# Altium schematic sheet 智能家居-网关.SchDoc
size A4
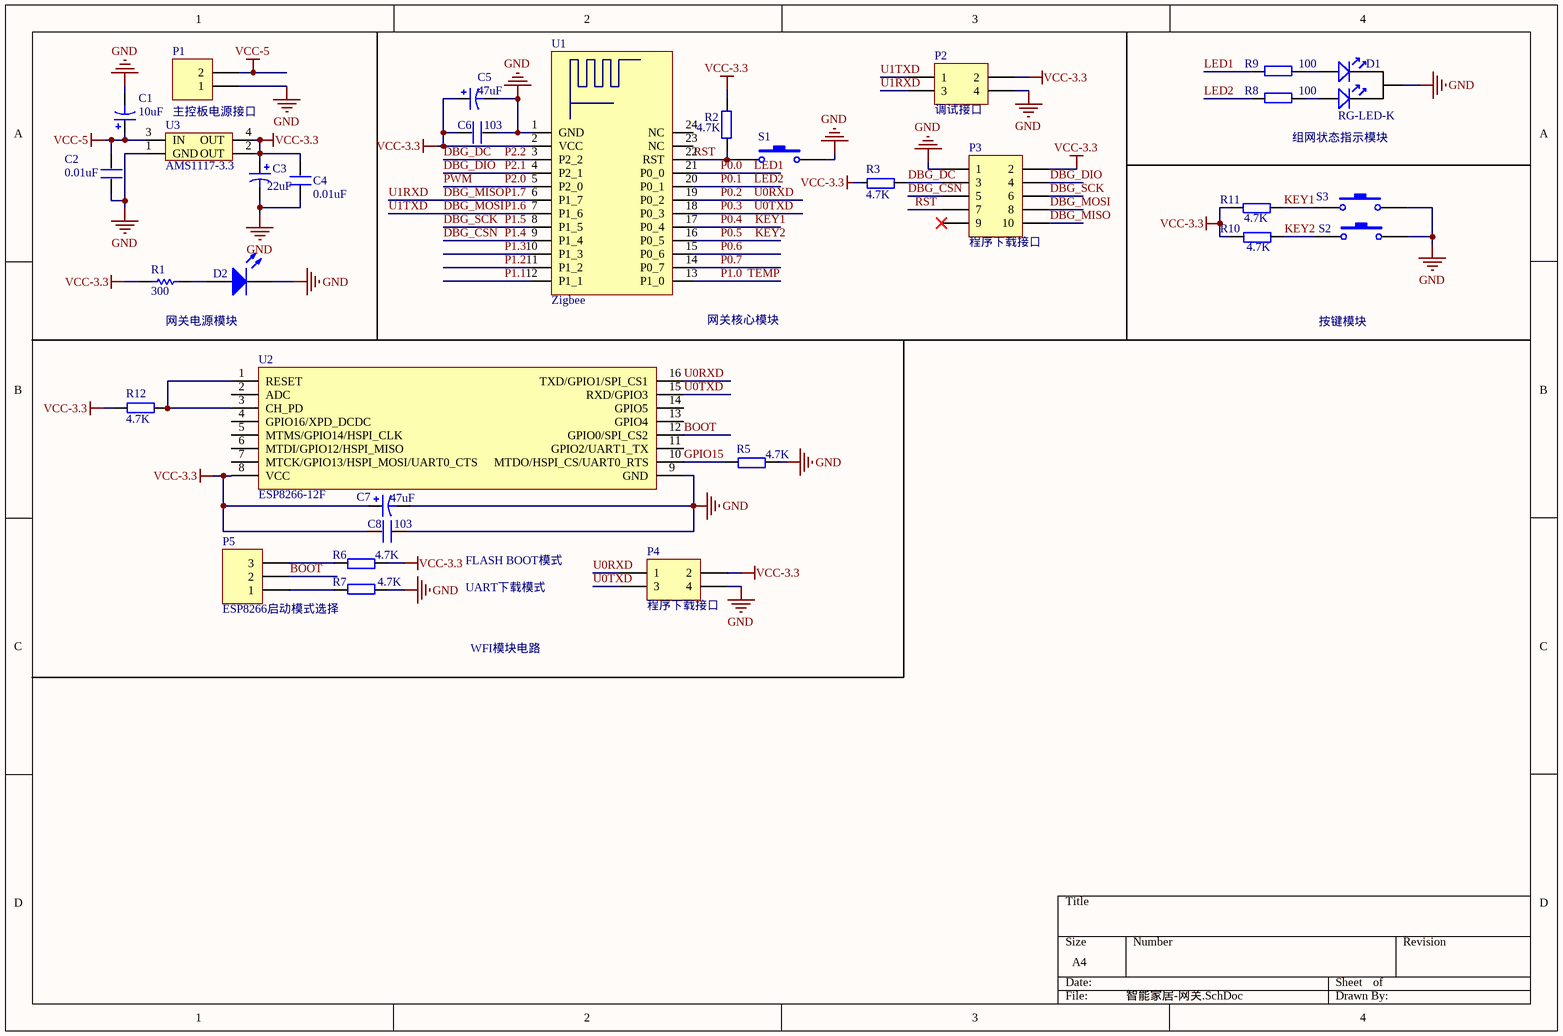
[diagram p0: 智能家居-网关.SchDoc]

## Parts
C1  value 10uF  [CD5]  (hidden comment: Cap Pol1)
C2  0.01uF  [0.1UF]
C3  value 22uF  [CD5]  (hidden comment: Cap Pol1)
C4  0.01uF  [0.1UF]
C5  value 47uF  [CD5]  (hidden comment: Cap Pol1)
C6  103  [0.1UF]
C7  value 47uF  [CD5]  (hidden comment: Cap Pol1)
C8  103  [0.1UF]
D1  RG-LED-K  [RG-LED]
D2  LED0  [LED-3]  (value not drawn)
P1  主控板电源接口  [DG1282]
P2  调试接口  [HDR2X2]
P3  程序下载接口  [HDR2X5]
P4  程序下载接口  [HDR2X2]
P5  ESP8266启动模式选择  [HDR1X3]
R1  value 300  [AXIAL-0.3]  (hidden comment: Res1)
R2  4.7K  [AXIAL-0.3]
R3  4.7K  [AXIAL-0.3]
R5  4.7K  [AXIAL-0.3]
R6  4.7K  [AXIAL-0.3]
R7  4.7K  [AXIAL-0.3]
R8  100  [AXIAL-0.3]
R9  100  [AXIAL-0.3]
R10  4.7K  [AXIAL-0.3]
R11  4.7K  [AXIAL-0.3]
R12  4.7K  [AXIAL-0.3]
S1  SW-PB  [KEY_M]  (value not drawn)
S2  SW-PB  [KEY_M]  (value not drawn)
S3  SW-PB  [KEY_M]  (value not drawn)
U1  Zigbee  [E18-MD0-1]
U2  ESP8266-12F  [ESP8266 - 12S]
U3  AMS1117-3.3  [AMS1117]

## Nets
GND: C1.2 C2.1 C3.2 C4.1 C5.2 C6.2 C7.2 C8.2 D1.2(GND) D2.2(K) P1.1 P2.4 P3.1 P4.4 R5.2 R7.1 S1.2 S2.2 S3.2 U1.1(GND) U2.9(GND) U3.1(GND)
VCC-3.3: C3.1 C4.2 C5.1 C6.1 C7.1 C8.1 P2.2 P3.2 P4.2 R1.1 R2.1 R3.1 R6.2 R10.1 R11.1 R12.2 U1.2(VCC) U2.8(VCC) U3.2(OUT) U3.4(OUT)
VCC-5: C1.1 C2.2 P1.2 U3.3(IN)
BOOT: P5.2 U2.12(GPIO0/SPI_CS2)
DBG_CSN: P3.5 U1.9(P1_4)  [also labelled P1.4]
DBG_DC: P3.3 R3.2 U1.3(P2_2)  [also labelled P2.2]
DBG_DIO: P3.4 U1.4(P2_1)  [also labelled P2.1]
DBG_MISO: P2.3 P3.10 U1.6(P1_7)  [also labelled P1.7, U1RXD]
DBG_MOSI: P2.1 P3.8 U1.7(P1_6)  [also labelled P1.6, U1TXD]
DBG_SCK: P3.6 U1.8(P1_5)  [also labelled P1.5]
GPIO15: R5.1 U2.10(MTDO/HSPI_CS/UART0_RTS)
KEY1: R11.2 S3.1 U1.17(P0_4)  [also labelled P0.4]
KEY2: R10.2 S2.1 U1.16(P0_5)  [also labelled P0.5]
LED1: R9.2 U1.21(P0_0)  [also labelled P0.0]
LED2: R8.2 U1.20(P0_1)  [also labelled P0.1]
P0.2: P4.1 U1.19(P0_2) U2.16(TXD/GPIO1/SPI_CS1)  [also labelled U0RXD]
P0.3: P4.3 U1.18(P0_3) U2.15(RXD/GPIO3)  [also labelled U0TXD]
P0.6: U1.15(P0_6)
P0.7: U1.14(P0_7)
P1.0: U1.13(P1_0)  [also labelled TEMP]
P1.1: U1.12(P1_1)
P1.2: U1.11(P1_2)
P1.3: U1.10(P1_3)
P2.0: U1.5(P2_0)  [also labelled PWM]
RST: P3.7 R2.2 S1.1 U1.22(RST)
NetD1_1: D1.1(R) R9.1
NetD1_3: D1.3(G) R8.1
NetD2_1: D2.1(A) R1.2
NetP5_1: P5.1 R7.2
NetP5_3: P5.3 R6.1
NetR12_1: R12.1 U2.1(RESET) U2.3(CH_PD)

Not connected (* = marked no-connect by the designer): P3 9*; U1 23(NC) 24(NC); U2 2(ADC) 4(GPIO16/XPD_DCDC) 5(MTMS/GPIO14/HSPI_CLK) 6(MTDI/GPIO12/HSPI_MISO) 7(MTCK/GPIO13/HSPI_MOSI/UART0_CTS) 11(GPIO2/UART1_TX) 13(GPIO4) 14(GPIO5)

## Notes on the sheet
- 组网状态指示模块
- 网关电源模块
- 网关核心模块
- 按键模块
- FLASH BOOT模式
- UART下载模式
- WFI模块电路

## Library data of the parts
C1 C3 C5 C7 = Cap Pol1: Polarized Capacitor (Radial); Published: 8-Jun-2000; LatestRevisionDate: 17-Jul-2002; LatestRevisionNote: Re-released for DXP Platform.; PackageReference: RB7.6-15; Publisher: Altium Limited; PackageDescription: Polarized Capacitor (Radial); 2 Leads
C2 C4 C6 C8 = C
D2 = LED0: Typical INFRARED GaAs LED; Published: 8-Jun-2000; LatestRevisionDate: 08-Jul-2005; LatestRevisionNote: Mech Layer 1 removed.; PackageReference: LED-0; Publisher: Altium Limited; PackageDescription: LED; 2 Leads
P1 = Header 2H: Header, 2-Pin, Right Angle; LatestRevisionDate: 17-Jul-2002; LatestRevisionNote: Re-released for DXP Platform.; Publisher: Altium Limited
P2 P4 = Header 2X2H: Header, 2-Pin, Dual row, Right Angle; LatestRevisionDate: 17-Jul-2002; LatestRevisionNote: Re-released for DXP Platform.; Publisher: Altium Limited
P3 = Header 5X2: Header, 5-Pin, Dual row; LatestRevisionDate: 17-Jul-2002; LatestRevisionNote: Re-released for DXP Platform.; Publisher: Altium Limited
P5 = Header 3: Header, 3-Pin; LatestRevisionDate: 17-Jul-2002; LatestRevisionNote: Re-released for DXP Platform.; Publisher: Altium Limited
R1 = Res1: Resistor; Published: 8-Jun-2000; LatestRevisionDate: 17-Jul-2002; LatestRevisionNote: Re-released for DXP Platform.; PackageReference: AXIAL-0.3; Publisher: Altium Limited; PackageDescription: Axial Device, Thru-Hole; 2 Leads; 0.3 in Pin Spacing
R2 R3 R5-R12 = R
S1-S3 = SW-PB: Switch; Published: 24-Mar-1999; LatestRevisionDate: 17-Jul-2002; LatestRevisionNote: Re-released for DXP Platform.; PackageReference: SPST-2; Publisher: Altium Limited; PackageDescription: Switch; 2 Leads
U1 = E18-MDO: Zigbee模块
U2 = ESP8266_12S
U3 = AMS1117